# Altium project PCB_Project.PrjPcb
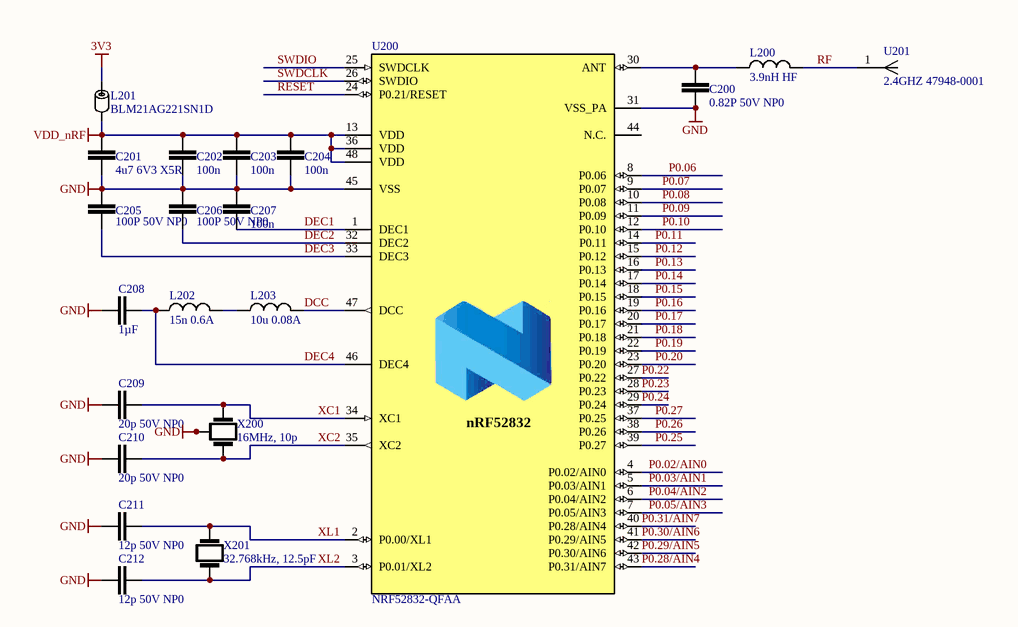
[diagram p0: MCU_nRF82532.SchDoc]
3 sheets, 35 parts. Net scope: global (net labels, ports and power ports of the same name join across sheets).
Sheets:
  NIXIE_CLOCK_V010.SchDoc
  MCU_nRF82532.SchDoc
  Misc.SchDoc

## Sheet NIXIE_CLOCK_V010.SchDoc
size A3

## Sheet MCU_nRF82532.SchDoc
size A4

### Parts
C200  0.82P 50V NP0  [CAPC1608N]
C201  4u7 6V3 X5R  [CAPC2012N]
C202  100n  [CAPC2012N]
C203  100n  [CAPC2012N]
C204  100n  [CAPC2012N]
C205  100P 50V NP0  [CAPC2012N]
C206  100P 50V NP0  [CAPC2012N]
C207  100n  [CAPC2012N]
C208  1µF  [CAPC2012N]
C209  20p 50V NP0  [CAPC2012N]
C210  20p 50V NP0  [CAPC2012N]
C211  12p 50V NP0  [CAPC2012N]
C212  12p 50V NP0  [CAPC2012N]
L200  3.9nH HF  [INDC2009N]
L201  BLM21AG221SN1D  [INDC2009N]
L202  15n 0.6A  [INDP6060X32N]
L203  10u 0.08A  [INDC2009N]
U200  NRF52832-QFAA  [QFN40P600X600X90-48N]
U201  2.4GHZ 47948-0001  [RF_ANT_CHIP_2.4GHZ_47948-0001]
X200  16MHz, 10p  [SMD3225]
X201  32.768kHz, 12.5pF  [ABS06]

### Nets
3V3: L201.1
GND: C200.1 C201.1 C202.2 C203.2 C204.2 C205.2 C206.2 C207.2 C208.1 C209.1 C210.1 C211.2 C212.2 U200.31(VSS_PA) U200.45(VSS) X200.2(GND) X200.4(GND)
VDD_nRF: C201.2 C202.1 C203.1 C204.1 L201.2 U200.13(VDD) U200.36(VDD) U200.48(VDD)
DCC: L203.2 U200.47(DCC)
DEC1: C207.1 U200.1(DEC1)
DEC2: C206.1 U200.32(DEC2)
DEC3: C205.1 U200.33(DEC3)
DEC4: C208.2 L202.1 U200.46(DEC4)
P0.02/AIN0: U200.4(P0.02/AIN0)
P0.03/AIN1: U200.5(P0.03/AIN1)
P0.04/AIN2: U200.6(P0.04/AIN2)
P0.05/AIN3: U200.7(P0.05/AIN3)
P0.06: U200.8(P0.06)
P0.07: U200.9(P0.07)
P0.08: U200.10(P0.08)
P0.09: U200.11(P0.09)
P0.10: U200.12(P0.10)
P0.11: U200.14(P0.11)
P0.12: U200.15(P0.12)
P0.13: U200.16(P0.13)
P0.14: U200.17(P0.14)
P0.15: U200.18(P0.15)
P0.16: U200.19(P0.16)
P0.17: U200.20(P0.17)
P0.18: U200.21(P0.18)
P0.19: U200.22(P0.19)
P0.20: U200.23(P0.20)
P0.22: U200.27(P0.22)
P0.23: U200.28(P0.23)
P0.24: U200.29(P0.24)
P0.25: U200.39(P0.27)
P0.26: U200.38(P0.26)
P0.27: U200.37(P0.25)
P0.28/AIN4: U200.43(P0.31/AIN7)
P0.29/AIN5: U200.42(P0.30/AIN6)
P0.30/AIN6: U200.41(P0.29/AIN5)
P0.31/AIN7: U200.40(P0.28/AIN4)
RESET: U200.24(P0.21/RESET)
RF: L200.2 U201.1(FT)
SWDCLK: U200.26(SWDIO)
SWDIO: U200.25(SWDCLK)
XC1: C209.2 U200.34(XC1) X200.1
XC2: C210.2 U200.35(XC2) X200.3
XL1: C211.1 U200.2(P0.00/XL1) X201.2
XL2: C212.1 U200.3(P0.01/XL2) X201.1
NetC200_2: C200.2 L200.1 U200.30(ANT)
NetL202_2: L202.2 L203.1

Not connected (* = marked no-connect by the designer): U200 44(N.C.)

### Notes on the sheet
- (in symbol IC MCU nRF52832_QFAA ARM M0 BLUETOOTH) nRF52832

### Library data of the parts
C200 = CAP 1608 0.82P 50V 5% NP0: YAGEO (PHYCOMP) - CC0603CRNPO9BNR82 - CAP, MLCC, C0G/NP0, 0.82PF, 50V, 0603; Initial Voltage: 0; Supplier 1: Farnell; Supplier Part Number 1: 721839; Manufacturer Part Number: CC0603CRNPO9BNR82; Manufacturer: YAGEO (PHYCOMP); Value: 0.82P
C201 = CAP 2012 4U7F 6.3V 10% X5R: KEMET - C0805C475K9PACTU - CAP, MLCC, X5R, 4.7UF, 6.3V, 0805; Initial Voltage: 0; Capacitance Tolerance: ± 10%; Value: 4.7; Voltage Rating: 6.3; Package / Case: 0805 (2012 Metric); Supplier 1: Farnell; Supplier Part Number 1: 9227857; Manufacturer Part Number: C0805C475K9PACTU; Manufacturer: KEMET; Operating Temperature Range: -55°C to +85
C202-C204 C207 = CAP 2012 100N 25V 10% X7R: Ceramic Capacitor; Surface-Mount; Manufacturer: WALSIN; Manufacturer Part Number: 0805B104K250CT; Tolerance: ± 10%; Rating: 25V; Dielectric Characteristic: X7R; Initial Voltage: 0; Value: 100n; Supplier 1: Farnell; Supplier Part Number 1: 2496943
C205 C206 = CAP 2012 100P 50V 10% NP0: KEMET - C0805C101J5GACTU - CAP, MLCC, C0G/NP0, 100PF, 50V, 0805; Initial Voltage: 0; Package / Case: 0805 (2012 Metric); Supplier 1: Farnell; Supplier Part Number 1: 1414656; Manufacturer: KEMET; Manufacturer Part Number: C0805C101J5GACTU; Value: 100P
C208 = CAP 2012 1U 25V 10% X7R: CAP CER 1UF 25V X7R 0805; Manufacturer Part Number: GRM21BR71E105KA99L; Manufacturer: Murata Electronics North America; Initial Voltage: 0; Value: 1µF; Supplier 1: Digi-Key; Supplier Part Number 1: 490-6484-1-ND; Package / Case: 0805 (2012 Metric)
C209 C210 = CAP 2012 20P 50V 10% NP0: CAP CER 22PF 50V NP0 0805; Manufacturer Part Number: C0805C200J5GACTU; Manufacturer: KEMET; Initial Voltage: 0; Voltage Rating: 50; Dielectric Characteristic: C0G / NP0; Tolerance: 5%; Package / Case: 0805 (2012 Metric); Value: 20p; Supplier 1: Farnell; Supplier Part Number 1: 2581087
C211 C212 = CAP 2012 12P 50V 10% NP0: WALSIN - 0805N120J500CT - CAPACITOR, MLCC, NP0, 12PF, 50V, 0805; Initial Voltage: 0; Value: 22pF; Dielectric Characteristic: C0G / NP0; Package / Case: 0805 (2012 Metric); Supplier 1: Farnell; Supplier Part Number 1: 2497013; Manufacturer: WALSIN; Manufacturer Part Number: 0805N120J500CT
L200 = IND 2012 3.9N 5% HF: COILCRAFT - 0805HT-3N9TJLB - INDUCTOR, RF, 3.9NH, 5%, 6.1GHZ, SMD; Inductance: 3.9; High Frequency Inductor Case: 0805 [2012 Metric]; Self Resonant Frequency Min: 6.1; Supplier 1: Farnell; Supplier Part Number 1: 2286484; Inductance Tolerance: ± 5%; Manufacturer Part Number: 0805HT-3N9TJLB; Manufacturer: COILCRAFT
L201 = IND 2012 FERRITE 220R @ 100MHz: MURATA - BLM21AG221SN1D - FERRITE BEAD, 0.13OHM, 800MA, 0805; Initial Current: 0; DC Current Rating: 200; DC Resistance Max: 0.13; Ferrite Case Style: 0805 [2012 Metric]; Impedance @ 100MHz: 220; Manufacturer: MURATA; Supplier 1: Farnell; Operating Temperature Min: -55; Operating Temperature Max: +125; Manufacturer Part Number: BLM21AG221SN1D; Supplier Part Number 1: 1515619
L202 = IND 2012 15N 0.6A 5%: VISHAY - IMC0805ER15NJ01 - HF INDUCTOR, 15NH, 600MA, 5% 3.6GHZ; DC Resistance Max: 0.08; Inductance: 15; Tolerance: 5%; Value: 15n; Supplier 1: Farnell; Manufacturer Part Number: IMC0805ER15NJ01; Manufacturer: VISHAY; Supplier Part Number 1: 1189465
L203 = IND 2012 10U 0.08A 5%: ISHAY - IMC0805ER100J01 - INDUCTOR, WIREWOUND, HIGH F; Manufacturer: VISHAY; Tolerance: 5%; Value: 10u; Supplier 1: Farnell; Supplier Part Number 1: 1653752; Manufacturer Part Number: IMC0805ER100J01
U200 = IC MCU nRF52832_QFAA ARM M0 BLUETOOTH: Multi-protocol Bluetooth Low Energy, ANT and 2.4GHz proprietary system-on-chip; Part number IPS: N.A.; Manufacturer: Nordic Semiconductor ASA; Manufacturer Part Number: NRF52832-QFAA-R; Memory Size: 512kB Flash, 64kB RAM; Voltage - Supply: 1.7 V ~ 3.6 V; Pin Count: 54; Supplier 1: Digi-Key; Package / Case: 48-VFQFN Exposed Pad; Category: RF/IF and RFID; Operating Temperature: -40°C ~ 85°C; Frequency: 2.4GHz; Supplier Part Number 1: 1490-1052-6-ND
U201 = RF ANT CHIP 2.4GHZ 47948-0001
X200 = XTAL SMD 16MHz 10P 20ppm: ABRACON - ABM10-16.000MHZ-D30-T3 - CRYSTAL, 16MHZ, 10PF, 2.5 X 2MM; Crystal Case: SMD, 2.5mm x 2; Load Capacitance: 10; Frequency Nom: 16; Supplier 1: Farnell; Operating Temperature Max: 85; Manufacturer: ABRACON; Operating Temperature Min: -40; Manufacturer Part Number: ABM10-16.000MHZ-D30-T3; value: 16MHz; Supplier Part Number 1: 2467762
X201 = XTAL SMD 32.768K 12.5P 20PPM: ABRACON - ABS06-32.768KHZ-T - CRYSTAL, 32.768KHZ, 12.5PF, SMD; Crystal Case: SMD, 2mm x 1.2; Frequency: 32.768; Supplier 1: Farnell; Manufacturer Part Number: ABS06-32.768KHZ-T; Operating Temperature Range: -40°C to +85; Manufacturer: ABRACON; value: 32.768kHz, 12.5pF; Supplier Part Number 1: 2101345

## Sheet Misc.SchDoc
size A4
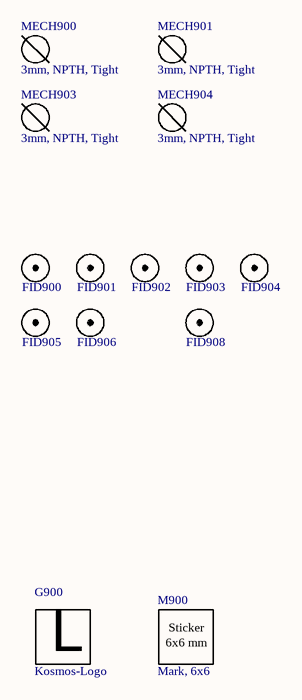
[diagram p1: Misc.SchDoc]

### Parts
FID900  FIDUCIAL ROUND 2,5MM  [FID100X300]  (value not drawn)  (no BOM)
FID901  FIDUCIAL ROUND 2,5MM  [FID100X300]  (value not drawn)  (no BOM)
FID902  FIDUCIAL ROUND 2,5MM  [FID100X300]  (value not drawn)  (no BOM)
FID903  FIDUCIAL ROUND 2,5MM  [FID100X300]  (value not drawn)  (no BOM)
FID904  FIDUCIAL ROUND 2,5MM  [FID100X300]  (value not drawn)  (no BOM)
FID905  FIDUCIAL ROUND 2,5MM  [FID100X300]  (value not drawn)  (no BOM)
FID906  FIDUCIAL ROUND 2,5MM  [FID100X300]  (value not drawn)  (no BOM)
FID908  FIDUCIAL ROUND 2,5MM  [FID100X300]  (value not drawn)  (no BOM)
G900  Kosmos-Logo  [KOSMOS_LOGO_S]  (no BOM)
M900  Mark, 6x6  [MARK_6X6_A]  (no BOM)
MECH900  3mm, NPTH, Tight  [MTGNP730H310P]  (no BOM)
MECH901  3mm, NPTH, Tight  [MTGNP730H310P]  (no BOM)
MECH903  3mm, NPTH, Tight  [MTGNP730H310P]  (no BOM)
MECH904  3mm, NPTH, Tight  [MTGNP730H310P]  (no BOM)

### Notes on the sheet
- (in symbol LOGO KOSMOS OVERLAY) L
- (in symbol STICKER MARK 6X6) Sticker; 6x6 mm

### Library data of the parts
FID900-FID906 FID908 = FIDUCIAL ROUND 2,5MM: Fiducial, Round, 1mm
G900 = LOGO KOSMOS OVERLAY: Kosmos-Logo-XL-Top-Overlay
M900 = STICKER MARK 6X6: Stick Mark, 6x6 mm,
MECH900 MECH901 MECH903 MECH904 = MH 3MM NPTH TIGHT: Mounting Hole, 3mm, Non-Plated, Tight-Fit